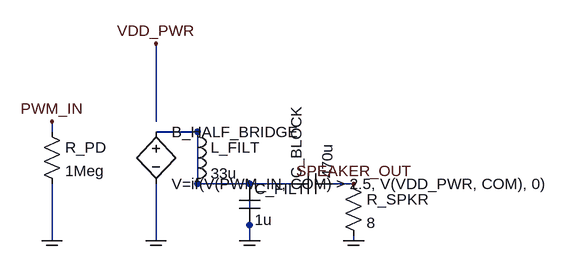
[diagram p0: schematic power_stage.asc]
power_stage.asc, the LTspice schematic file:
Version 4
SHEET 1 1400 800
FLAG 160 200 PWM_IN
FLAG 320 80 VDD_PWR
FLAG 160 384 COM
FLAG 320 384 COM
FLAG 464 384 COM
FLAG 624 384 COM
FLAG 624 296 SPEAKER_OUT
SYMBOL res 144 200 R0
SYMATTR InstName R_PD
SYMATTR Value 1Meg
WIRE 160 200 160 216
WIRE 160 296 160 384
WIRE 320 80 320 200
SYMBOL bv 320 200 R0
SYMATTR InstName B_HALF_BRIDGE
SYMATTR Value V=if(V(PWM_IN, COM) > 2.5, V(VDD_PWR, COM), 0)
WIRE 320 216 384 216
WIRE 320 296 320 384
SYMBOL ind 368 200 R0
SYMATTR InstName L_FILT
SYMATTR Value 33u
WIRE 384 216 384 296
WIRE 384 296 464 296
SYMBOL cap 448 296 R0
SYMATTR InstName C_FILT
SYMATTR Value 1u
WIRE 464 296 464 360
WIRE 464 360 464 384
WIRE 464 296 528 296
SYMBOL cap 528 312 R270
SYMATTR InstName C_BLOCK
SYMATTR Value 470u
WIRE 592 296 624 296
SYMBOL res 608 280 R0
SYMATTR InstName R_SPKR
SYMATTR Value 8
WIRE 624 376 624 384

The netlist it stands for:
* power_stage.asc
R_PD PWM_IN COM 1Meg
B_HALF_BRIDGE COM COM V=if(V(PWM_IN, COM) > 2.5, V(VDD_PWR, COM), 0)
L_FILT COM COM 33u
C_FILT COM COM 1u
C_BLOCK COM SPEAKER_OUT 470u
R_SPKR SPEAKER_OUT COM 8
.backanno
.end